# EAGLE design esquematico programador (EAGLE 5.06)
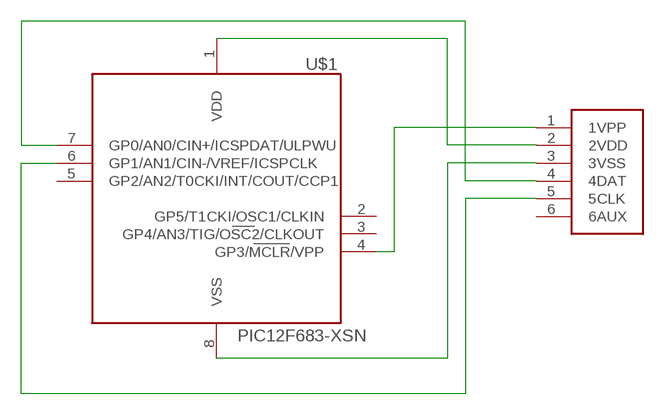
[diagram p0: schematic, sheet 1]

## Parts
U$1  PIC12F683.  [PIC12F683_PATRON_RECOMENDADO]
U$2  TIRADEPINES  [TIRADEPINES]

## Nets
N$1: U$1.4(GP3/MCLR/VPP) U$2.1(1VPP)
N$2: U$1.1(VDD) U$2.2(2VDD)
N$3: U$1.8(VSS) U$2.3(3VSS)
N$4: U$1.7(GP0/AN0/CIN+/ICSPDAT/ULPWU) U$2.4(4DAT)
N$5: U$1.6(GP1/AN1/CIN-/VREF/ICSPCLK) U$2.5(5CLK)
Unconnected: U$1.2(GP5/T1CKI/OSC1/CLKIN) U$1.3(GP4/AN3/TIG/OSC2/CLKOUT) U$1.5(GP2/AN2/T0CKI/INT/COUT/CCP1) U$2.6(6AUX)

## Library data of the parts
U$1 = PIC 12F683:PIC12F683
U$2 = Tira de oines:TIRADEPINES

## Board
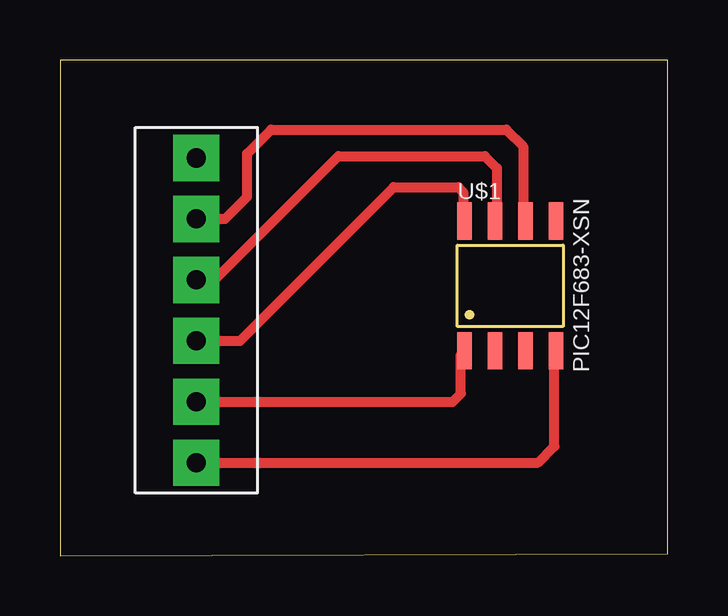
[diagram p1: board, top side]

Size 25.32 x 20.65 mm. Coordinates in mm from the lower left corner, seen from the top.
Outline: 0,0 25.32,0.08 25.32,20.65 0,20.65 0,0
Copper layers (1*16): Top 0.035mm / dielectric 1.5mm / Bottom 0.035mm
Design rules "default": minimum track width 10mil, minimum drill 24mil, track to track 8mil, track to pad 8mil, pad to pad 8mil, via to via 8mil, smd to smd 8mil, copper to edge 40mil, drill to drill 8mil, minimum pad ring 10mil, minimum via ring 8mil, stop-mask expansion 4mil, vias tented up to drill 0mil, thermal gap 10mil

### Footprints (pad centres in the part's own frame; a part is rotated, then mirrored left to right if it is on the bottom)
PIC12F683_PATRON_RECOMENDADO = smd 0.6 x 1.55: 1 0,0; 2 1.27,0; 3 2.54,0; 4 3.81,0; 5 3.81,5.4; 6 2.54,5.4; 7 1.27,5.4; 8 0,5.4
TIRADEPINES = drill 0.8 pad 1.93 square: 1 0,5.08; 2 0,2.54; 3 0,0; 4 0,-2.54; 5 0,-5.08; 6 0,-7.62

### Placement (x,y rotation side)
U$1  16.86,8.54 0 top
U$2  5.68,8.95 180 top

### Tracks (layer width: path | path; a pad name or v marks a point on that pad's centre or on a via)
N$1
  Top 0.406: U$2.1 19.92,3.87 20.6,4.55 20.6,8.47 U$1.4
N$2
  Top 0.406: U$2.2 16.36,6.41 16.7,6.75 16.7,8.38 U$1.1
N$3
  Top 0.406: U$2.3 7.5,8.95 13.9,15.35 16.6,15.35 16.8,15.15 16.8,14 U$1.8
N$4
  Top 0.406: U$2.4 6.44,11.49 11.6,16.65 17.7,16.65 18.2,16.15 18.2,14.01 U$1.7
N$5
  Top 0.406: U$2.5 6.88,14.03 7.8,14.95 7.8,16.75 8.8,17.75 18.6,17.75 19.3,17.05 19.3,14.04 U$1.6